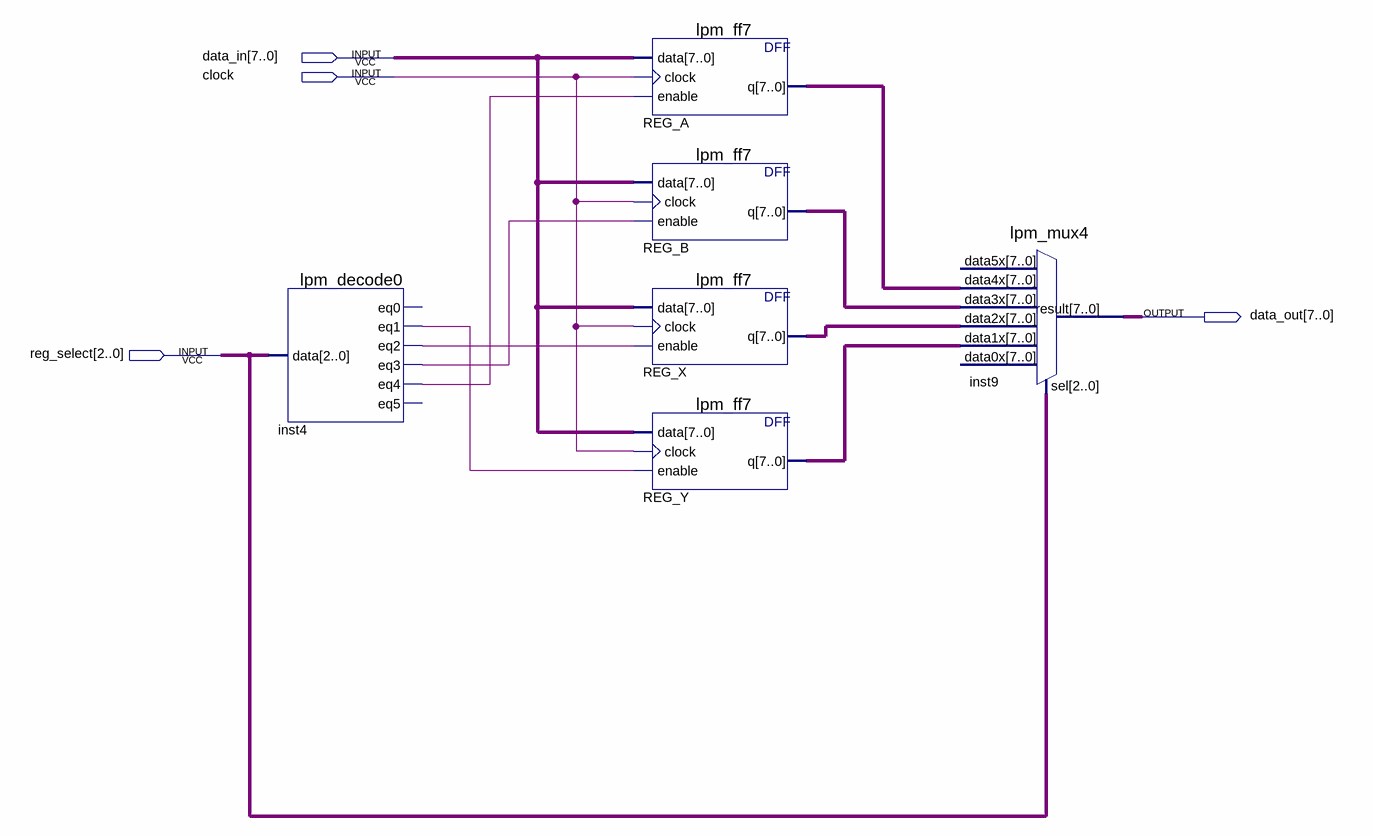
[diagram p0: schematic sheet]
// Quartus schematic regs.bdf as structural Verilog: 6 symbols, 4 pins
module regs (
  input  [7:0] data_in,
  input  clock,
  input  [2:0] reg_select,
  output [7:0] data_out
);

  wire inst4_eq1, inst4_eq2, inst4_eq3, inst4_eq4;
  wire [7:0] REG_A_q, REG_B_q, REG_X_q, REG_Y_q;

  lpm_decode0 inst4 (
    .data(reg_select), .eq1(inst4_eq1), .eq2(inst4_eq2), .eq3(inst4_eq3), .eq4(inst4_eq4));  // open: eq0, eq5
  lpm_ff7 REG_A (.data(data_in), .clock(clock), .enable(inst4_eq4), .q(REG_A_q));
  lpm_ff7 REG_B (.data(data_in), .clock(clock), .enable(inst4_eq3), .q(REG_B_q));
  lpm_ff7 REG_X (.data(data_in), .clock(clock), .enable(inst4_eq2), .q(REG_X_q));
  lpm_ff7 REG_Y (.data(data_in), .clock(clock), .enable(inst4_eq1), .q(REG_Y_q));
  lpm_mux4 inst9 (
    .data4x(REG_A_q), .data3x(REG_B_q), .data2x(REG_X_q), .data1x(REG_Y_q), .sel(reg_select),
    .result(data_out));  // open: data5x, data0x
endmodule
